# Altium schematic sheet schematic.SchDoc
size A3
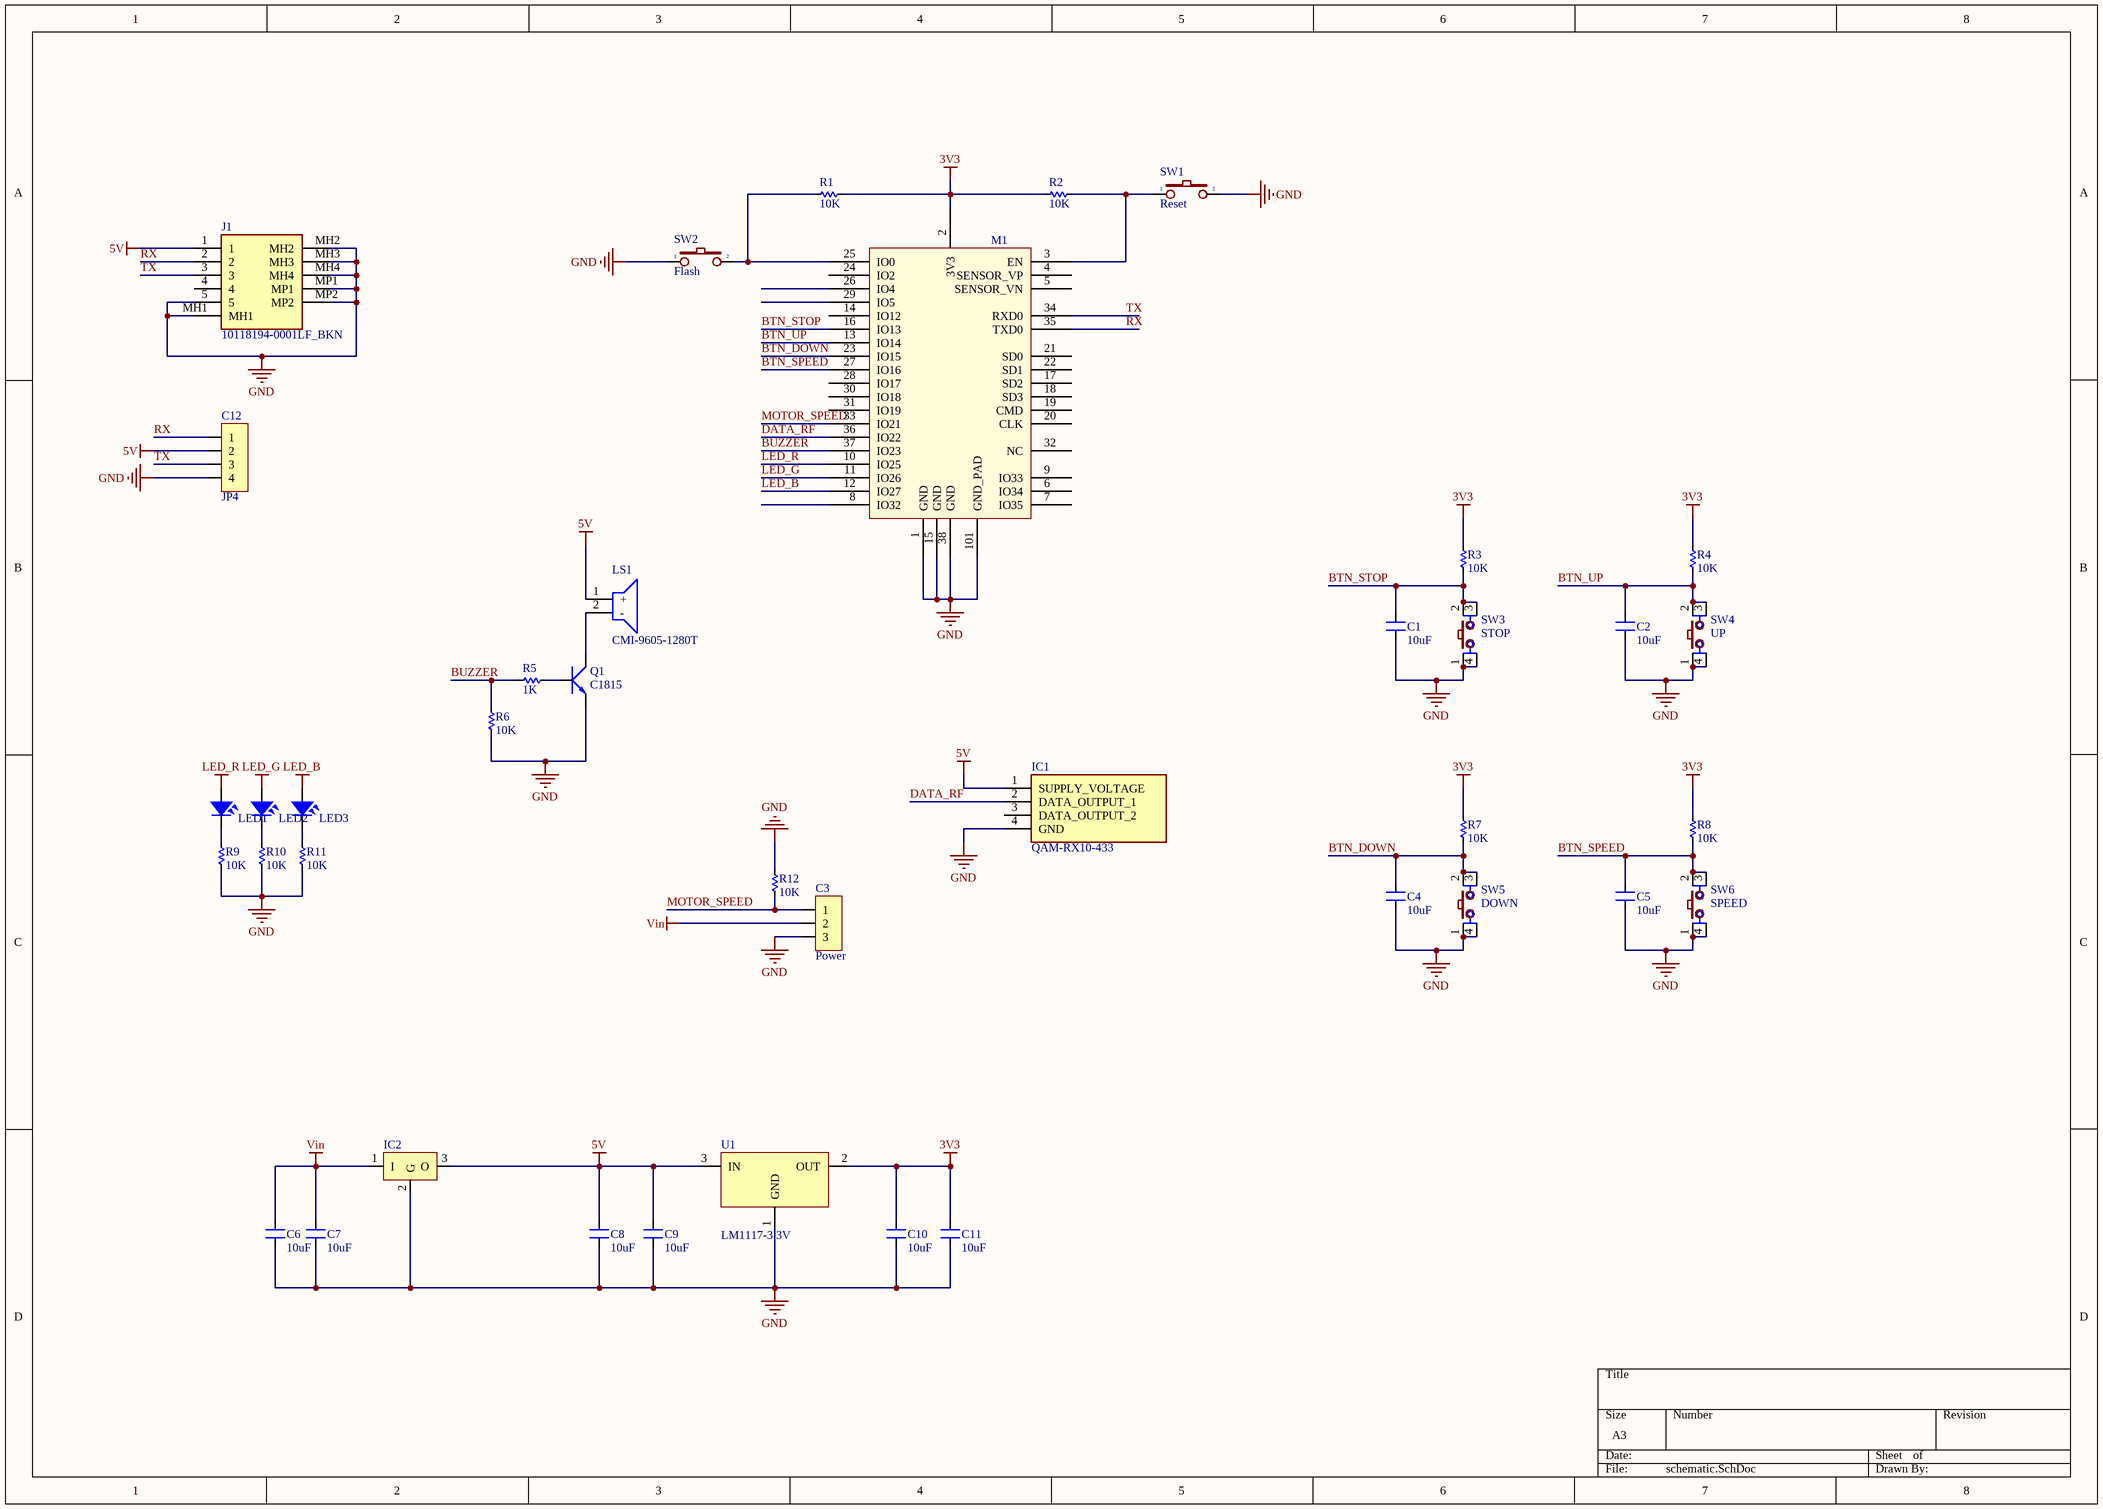
[diagram p0: schematic.SchDoc]

## Parts
C1  10uF  [CN-SMD-0603]
C2  10uF  [CN-SMD-0603]
C3  Power  [JP3-D1C]
C4  10uF  [CN-SMD-0603]
C5  10uF  [CN-SMD-0603]
C6  10uF  [CN-SMD-0603]
C7  10uF  [CN-SMD-0603]
C8  10uF  [CN-SMD-0603]
C9  10uF  [CN-SMD-0603]
C10  10uF  [CN-SMD-0603]
C11  10uF  [CN-SMD-0603]
C12  JP4  [JP4-C1T]
IC1  QAM-RX10-433  [QAMRX10433]
IC2  LM78xx  [TO252-123]  (value not drawn)
J1  10118194-0001LF_BKN  [101181940001LFBKN]
LED1  LED  [LED-3MM-BLUE]  (value not drawn)
LED2  LED  [LED-3MM-BLUE]  (value not drawn)
LED3  LED  [LED-3MM-BLUE]  (value not drawn)
LS1  CMI-9605-1280T  [CMI96051280T]
M1  ESP32S_Module  [ESP32S]  (value not drawn)
Q1  C1815  [SOT23B]
R1  10K  [RES-SMD-0603]
R2  10K  [RES-SMD-0603]
R3  10K  [RES-SMD-0603]
R4  10K  [RES-SMD-0603]
R5  1K  [RES-SMD-0603]
R6  10K  [RES-SMD-0603]
R7  10K  [RES-SMD-0603]
R8  10K  [RES-SMD-0603]
R9  10K  [RES-SMD-0603]
R10  10K  [RES-SMD-0603]
R11  10K  [RES-SMD-0603]
R12  10K  [RES-SMD-0603]
SW1  Reset  [SW1-SMD]
SW2  Flash  [SW-DIP1-1]
SW3  STOP  [SW2-SMD]
SW4  UP  [SW2-SMD]
SW5  DOWN  [SW2-SMD]
SW6  SPEED  [SW2-SMD]
U1  LM1117-3.3V  [SOT223]

## Nets
3V3: C10.1 C11.1 M1.2(3V3) R1.1 R2.2 R3.1 R4.1 R7.1 R8.1 U1.2(OUT)
5V: C8.1 C9.1 C12.2 IC1.1(SUPPLY_VOLTAGE) IC2.3(O) J1.1 LS1.1(+) U1.3(IN)
GND: C1.2 C2.2 C3.3 C4.2 C5.2 C6.2 C7.2 C8.2 C9.2 C10.2 C11.2 C12.4 IC1.4(GND) IC2.2(G) J1.5 J1.MH1 J1.MH2 J1.MH3 J1.MH4 J1.MP1 J1.MP2 M1.1(GND) M1.15(GND) M1.38(GND) M1.101(GND_PAD) Q1.1(E) R6.2 R9.1 R10.1 R11.1 R12.1 SW1.2 SW2.1 SW3.1 SW3.4 SW4.1 SW4.4 SW5.1 SW5.4 SW6.1 SW6.4 U1.1(GND)
LED_B: LED3.1 M1.12(IO27)
LED_G: LED2.1 M1.11(IO26)
LED_R: LED1.1 M1.10(IO25)
Vin: C3.2 C6.1 C7.1 IC2.1(I)
BTN_DOWN: C4.1 M1.23(IO15) R7.2 SW5.2 SW5.3
BTN_SPEED: C5.1 M1.27(IO16) R8.2 SW6.2 SW6.3
BTN_STOP: C1.1 M1.16(IO13) R3.2 SW3.2 SW3.3
BTN_UP: C2.1 M1.13(IO14) R4.2 SW4.2 SW4.3
BUZZER: M1.37(IO23) R5.2 R6.1
DATA_RF: IC1.2(DATA_OUTPUT_1) M1.36(IO22)
MOTOR_SPEED: C3.1 M1.33(IO21) R12.2
RX: C12.1 J1.2 M1.35(TXD0)
TX: C12.3 J1.3 M1.34(RXD0)
NetLED1_2: LED1.2 R9.2
NetLED2_2: LED2.2 R10.2
NetLED3_2: LED3.2 R11.2
NetLS1_2: LS1.2(-) Q1.2(C)
NetM1_3: M1.3(EN) R2.1 SW1.1
NetM1_25: M1.25(IO0) R1.2 SW2.2
NetQ1_3: Q1.3(B) R5.1

Not connected (* = marked no-connect by the designer): IC1 3(DATA_OUTPUT_2); J1 4; M1 4(SENSOR_VP) 5(SENSOR_VN) 6(IO34) 7(IO35) 8(IO32) 9(IO33) 14(IO12) 17(SD2) 18(SD3) 19(CMD) 20(CLK) 21(SD0) 22(SD1) 24(IO2) 26(IO4) 28(IO17) 29(IO5) 30(IO18) 31(IO19) 32(NC)

## Library data of the parts
C1 C2 C4-C11 = CN: Tu gom; Value: 33pF
C3 = JP3: WR-PHD 2.54 mm Angled Socket Header; Manufacturer: W¨¹rth Elektronik eiSos GmbH; partNo: 613003143121; ComponentLink1 Description: Manufacturer; ComponentLink2 Description: Datasheet; NoPins: 03; Created Date: 29 March 2013; ComponentLink1URL: http://www.we-online.com; ComponentLink2URL: http://katalog.we-online.de/em/datasheet/6130xx143121.pdf; Created by: Karrer Zheng
C12 = JP4: WR-PHD 2.54 mm Angled Socket Header; Manufacturer: W¨¹rth Elektronik eiSos GmbH; partNo: 613004143121; ComponentLink1 Description: Manufacturer; ComponentLink2 Description: Datasheet; NoPins: 04; Created Date: 29 March 2013; ComponentLink1URL: http://www.we-online.com; ComponentLink2URL: http://katalog.we-online.de/em/datasheet/6130xx143121.pdf; Created by: Karrer Zheng
IC1 = QAM-RX10-433: Integrated Circuit; Manufacturer_Name: RF SOLUTIONS; Datasheet Link: https://datasheet.datasheetarchive.com/originals/distributors/DKDS-5/87948.pdf; Height: 8.5mm; Manufacturer_Part_Number: QAM-RX10-433; Mouser Part Number: 223-QAM-RX10-433; Mouser Price/Stock: https://www.mouser.co.uk/ProductDetail/RF-Solutions/QAM-RX10-433?qs=OlC7AqGiEDlp3OsUKop0pA%3D%3D
IC2 = LM78xx: Positive Voltage Regulator; Note: Tab is connected to pin 3 (GND).; Published: 24-Aug-2001; LatestRevisionDate: 17-Jul-2002; LatestRevisionNote: Re-released for DXP Platform.; DatasheetVersion: Apr-1994; PackageVersion: Jul-1998; PackageReference: ISOWATT220AB; Publisher: Altium Limited; PackageDescription: TO, Thru-Hole, Vertical, Heatsink Mounted; 3 In-Line Leads; Pitch 2.54 mm; Pin sequence 1, 3, 2; ComponentLink1Description: Manufacturer Link; ComponentLink1URL: http://www.st.com/; ComponentLink2Description: Datasheet; ComponentLink2URL: http://www.st.com/stonline/products/literature/ds/2146/l78m05c.pdf
J1 = 10118194-0001LF_BKN: Connector; Manufacturer_Name: Amphenol; Manufacturer_Part_Number: 10118194-0001LF/BKN; Datasheet Link: https://cdn.amphenol-cs.com/media/wysiwyg/files/drawing/10118194.pdf; Height: 2.78mm
LED1-LED3 = LED: LED Single colour Green and Red; Value: LED 3 ly Single Colour
LS1 = CMI-9605-1280T: Loudspeaker or Buzzer; Manufacturer_Name: CUI Devices; Datasheet Link: https://www.mouser.com/datasheet/2/670/cmi-9605-1280t-1627757.pdf; Height: 5.5mm; Manufacturer_Part_Number: CMI-9605-1280T; Mouser Part Number: 490-CMI-9605-1280T; Mouser Price/Stock: https://www.mouser.co.uk/ProductDetail/CUI-Devices/CMI-9605-1280T?qs=P1JMDcb91o4jVbreCBkoMQ%3D%3D; Arrow Part Number: CMI-9605-1280T; Arrow Price/Stock: https://www.arrow.com/en/products/cmi-9605-1280t/cui-devices?region=nac
M1 = ESP32S_Module: Esp-32S; Datasheet: https://espressif.com/sites/default/files/documentation/esp_wroom_32_datasheet_en.pdf
Q1 = C1815: NPN 600mW, ECB; Value: C1815
R1-R12 = Res-SMD: Resistor; Manufacturer: Generic Components; Class: Passive; Published: 08/06/2000; Publisher: Altium Hobart Technology Centre
SW1 SW2 = SW2: Switch button 2 pin; Value: SW chip 2 pin
SW3-SW6 = SW4: Switch button 4 pin; Value: Button chip 4 pin
U1 = LM1117: 800mA Low-Dropout Linear Regulator; Creator: Nguyen Ba Bien; Website: http://group3i.net